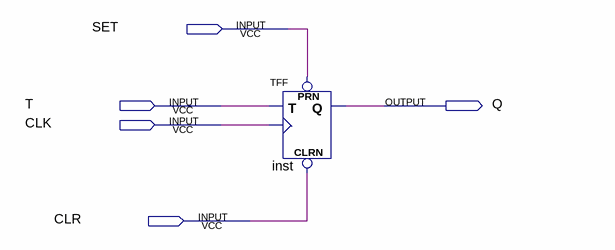
[diagram p0: schematic sheet]
// Quartus schematic TFLIPFLOP.bdf as structural Verilog: 1 symbols, 5 pins
module TFLIPFLOP (
  input  SET,
  input  T,
  input  CLK,
  input  CLR,
  output Q
);

  TFF inst (.PRN(SET), .CLRN(CLR), .T(T), .CLK(CLK), .Q(Q));
endmodule
